# EAGLE design aes4 to 6 (EAGLE 9.4.0)
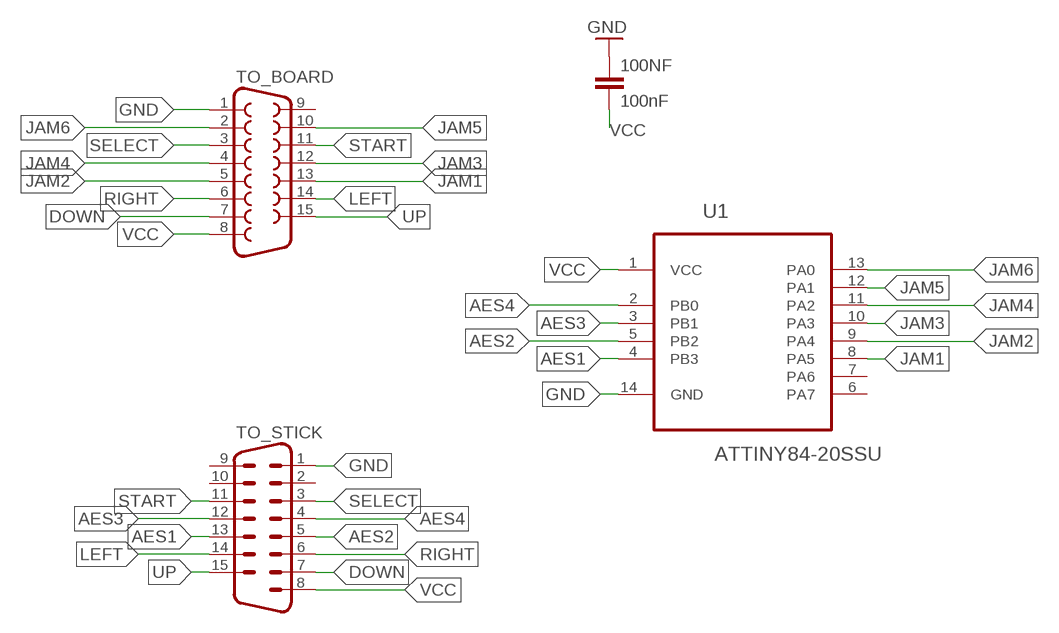
[diagram p0: schematic, sheet 1]

## Parts
100NF  100nF  10PF-0603-50V-5%  [0603]
TO_BOARD  F15D  [F15D]
TO_STICK  M15D  [M15D]
U1  ATTINY84-20SSU  [SOIC127P600X175-14N]

## Nets
AES1: TO_STICK.13 U1.4(PB3)
AES2: TO_STICK.5 U1.5(PB2)
AES3: TO_STICK.12 U1.3(PB1)
AES4: TO_STICK.4 U1.2(PB0)
DOWN: TO_BOARD.7 TO_STICK.7
GND: 100NF.1 TO_BOARD.1 TO_STICK.1 U1.14(GND)
JAM1: TO_BOARD.13 U1.8(PA5)
JAM2: TO_BOARD.5 U1.9(PA4)
JAM3: TO_BOARD.12 U1.10(PA3)
JAM4: TO_BOARD.4 U1.11(PA2)
JAM5: TO_BOARD.10 U1.12(PA1)
JAM6: TO_BOARD.2 U1.13(PA0)
LEFT: TO_BOARD.14 TO_STICK.14
RIGHT: TO_BOARD.6 TO_STICK.6
SELECT: TO_BOARD.3 TO_STICK.3
START: TO_BOARD.11 TO_STICK.11
UP: TO_BOARD.15 TO_STICK.15
VCC: 100NF.2 TO_BOARD.8 TO_STICK.8 U1.1(VCC)
Unconnected: TO_BOARD.9 TO_STICK.2 TO_STICK.9 TO_STICK.10 U1.6(PA7) U1.7(PA6)

## Library data of the parts
100NF = SparkFun-Capacitors:10PF: 10pF ceramic capacitors A capacitor is a passive two-terminal electrical component used to store electrical energy temporarily in an electric field.; PROD_ID: CAP-11812; VALUE: 10pF
TO_BOARD = con-subd:F15: SUB-D; OC_FARNELL: unknown; OC_NEWARK: unknown
TO_STICK = con-subd:M15: SUB-D; OC_FARNELL: unknown; OC_NEWARK: unknown
U1 = Attiny84:ATTINY84-20SSU: 8-bit Microcontroller with Bytes In-System Programmable Flash; MPN: ATTINY84-20SSU; OC_FARNELL: 1636955; OC_NEWARK: 68T3784; PACKAGE: SOIC-14; SUPPLIER: Atmel

## Net classes
1 GND: width 0.305 mm
2 VCC: width 0.305 mm

## Board
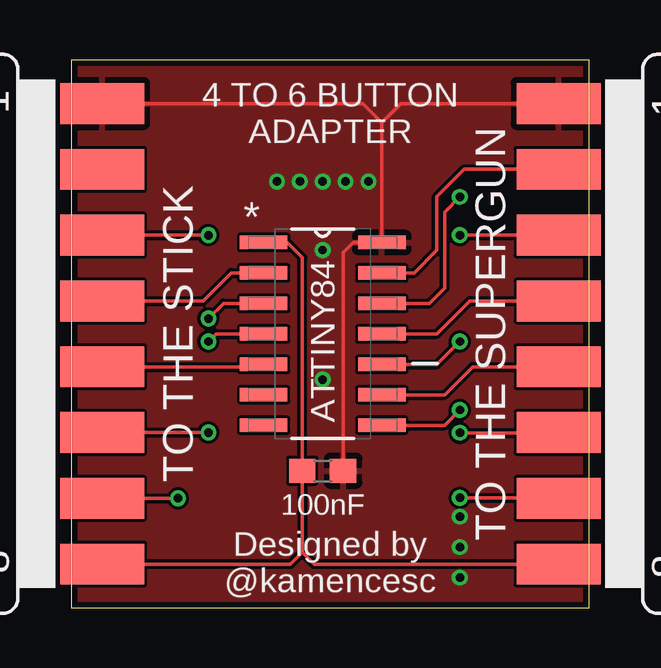
[diagram p1: board, top side]
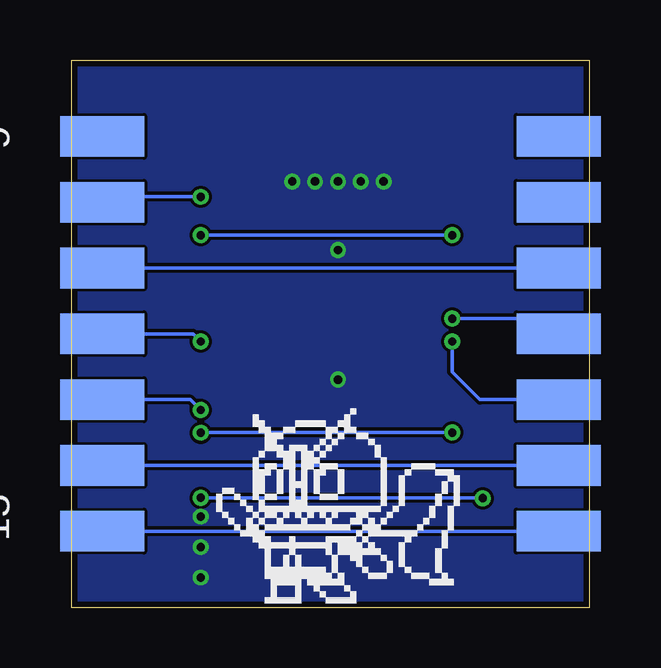
[diagram p2: board, bottom side, seen from below]

Size 21.58 x 22.85 mm. Coordinates in mm from the lower left corner, seen from the top.
Outline: 0,0 21.58,0 21.58,22.85 0,22.85 0,0
Copper layers (1*16): Top 0.035mm / dielectric 1.5mm / Bottom 0.035mm
Design rules "dirtypcbs_2_layer": minimum track width 5mil, minimum drill 12mil, track to track 5mil, track to pad 5mil, pad to pad 5mil, via to via 5mil, smd to smd 0mil, copper to edge 10mil, drill to drill 10mil, minimum pad ring 10mil, minimum via ring 6mil, stop-mask expansion 2mil, vias tented up to drill 25mil, thermal gap 10mil

### Footprints (pad centres in the part's own frame; a part is rotated, then mirrored left to right if it is on the bottom)
0603 = smd 1.1 x 1: 1 -0.85,0; 2 0.85,0
F15D = smd 1.7 x 3.5: 1 -9.601,-6.045; 2 -6.858,-6.045; 3 -4.115,-6.045; 4 -1.372,-6.045; 5 1.372,-6.045; 6 4.115,-6.045; 7 6.858,-6.045; 8 9.601,-6.045 | smd 1.7 x 3.5 bottom: 9 -8.23,-6.045; 10 -5.486,-6.045; 11 -2.743,-6.045; 12 0,-6.045; 13 2.743,-6.045; 14 5.486,-6.045; 15 8.23,-6.045
M15D = smd 1.7 x 3.5: 1 9.601,-6.045; 2 6.858,-6.045; 3 4.115,-6.045; 4 1.372,-6.045; 5 -1.372,-6.045; 6 -4.115,-6.045; 7 -6.858,-6.045; 8 -9.601,-6.045 | smd 1.7 x 3.5 bottom: 9 8.23,-6.045; 10 5.486,-6.045; 11 2.743,-6.045; 12 0,-6.045; 13 -2.743,-6.045; 14 -5.486,-6.045; 15 -8.23,-6.045
SOIC127P600X175-14N = smd 1.981 x 0.559: 1 -2.464,3.81; 2 -2.464,2.54; 3 -2.464,1.27; 4 -2.464,0; 5 -2.464,-1.27; 6 -2.464,-2.54; 7 -2.464,-3.81; 8 2.464,-3.81; 9 2.464,-2.54; 10 2.464,-1.27; 11 2.464,0; 12 2.464,1.27; 13 2.464,2.54; 14 2.464,3.81

### Placement (x,y rotation side)
100NF  10.48,5.71 180 top
TO_BOARD  26.35,11.43 270 top
TO_STICK  -4.76,11.43 90 top
U1  10.48,11.43 0 top

### Tracks (layer width: path | path; a pad name or v marks a point on that pad's centre or on a via)
AES1  (via drill 0.35)
  Top 0.152: v5.71,11.11 6.03,11.43 U1.4
  Bottom 0.152: TO_STICK.13 4.56,8.69 5.71,9.84 v5.71,11.11
AES2
  Top 0.152: TO_STICK.5 7.91,10.06 U1.5
AES3  (via drill 0.35)
  Top 0.152: v5.71,12.06 6.35,12.7 U1.3
  Bottom 0.152: TO_STICK.12 1.92,12.06 v5.71,12.06
AES4
  Top 0.152: TO_STICK.4 5.5,12.8 6.67,13.97 U1.2
DOWN  (via drill 0.35)
  Top 0.152: TO_STICK.7 v4.45,4.57 | v16.19,4.59 20.31,4.59 TO_BOARD.7
  Bottom 0.152: v4.45,4.57 4.45,4.59 v16.19,4.59
GND  (via drill 0.35)
  Top 0.152: 12.94,20.24 U1.14 11.75,15.24 11.33,14.82 100NF.1 | TO_BOARD.1 13.73,21.03 12.94,20.24 | 12.94,20.24 12.15,21.03 TO_STICK.1
  other vias: 8.57,17.78 9.53,17.78 10.48,17.78 11.43,17.78 12.38,17.78 10.48,14.92 10.48,9.53 16.19,2.54 16.19,3.81 16.19,1.27
  pour Bottom: 0,22.86 21.59,22.86 21.59,0 0,0
  pour Top: 0,22.86 21.59,22.86 21.59,0 0,0
JAM1  (via drill 0.35)
  Top 0.152: v16.19,8.26 15.56,7.62 U1.8
  Bottom 0.152: v16.19,8.26 16.62,8.69 TO_BOARD.13
JAM2
  Top 0.152: U1.9 15.56,8.89 16.73,10.06 TO_BOARD.5
JAM3  (via drill 0.35)
  Top 0.152: U1.10 15.24,10.16 v16.19,11.11
  Bottom 0.152: v16.19,11.11 16.51,11.43 TO_BOARD.12
JAM4
  Top 0.152: U1.11 15.24,11.43 16.61,12.8 TO_BOARD.4
JAM5  (via drill 0.35)
  Top 0.152: U1.12 14.92,12.7 15.56,13.34 15.56,16.51 v16.19,17.14
  Bottom 0.152: v16.19,17.14 20.08,17.14 TO_BOARD.10
JAM6
  Top 0.152: U1.13 14.29,13.97 15.24,14.92 15.24,17.14 16.38,18.29 TO_BOARD.2
LEFT
  Bottom 0.152: TO_STICK.14 TO_BOARD.14
RIGHT  (via drill 0.35)
  Top 0.152: TO_STICK.6 v5.71,7.32 | v16.19,7.3 20.3,7.3 TO_BOARD.6
  Bottom 0.152: v5.71,7.32 16.18,7.32 v16.19,7.3
SELECT  (via drill 0.35)
  Top 0.152: TO_STICK.3 v5.71,15.54 | v16.19,15.54 TO_BOARD.3
  Bottom 0.152: v5.71,15.54 v16.19,15.54
START
  Bottom 0.152: TO_STICK.11 TO_BOARD.11
UP
  Bottom 0.152: TO_STICK.15 TO_BOARD.15
VCC
  Top 0.152: U1.1 8.99,15.24 9.63,14.61 100NF.2 9.63,2.33 | TO_STICK.8 9.13,1.83 9.63,2.33 | TO_BOARD.8 10.12,1.83 9.63,2.33

### Text on the board
tPlace: 4 TO 6 BUTTON / ADAPTER | TO THE STICK | ATTINY84 | TO THE SUPERGUN | 100nF | Designed by / @kamencesc